# EAGLE design simple_record (EAGLE 6.5.0)
AUTHOR: Joshua Adkins; REV: B; TITLE: SIMPLE_RECORD
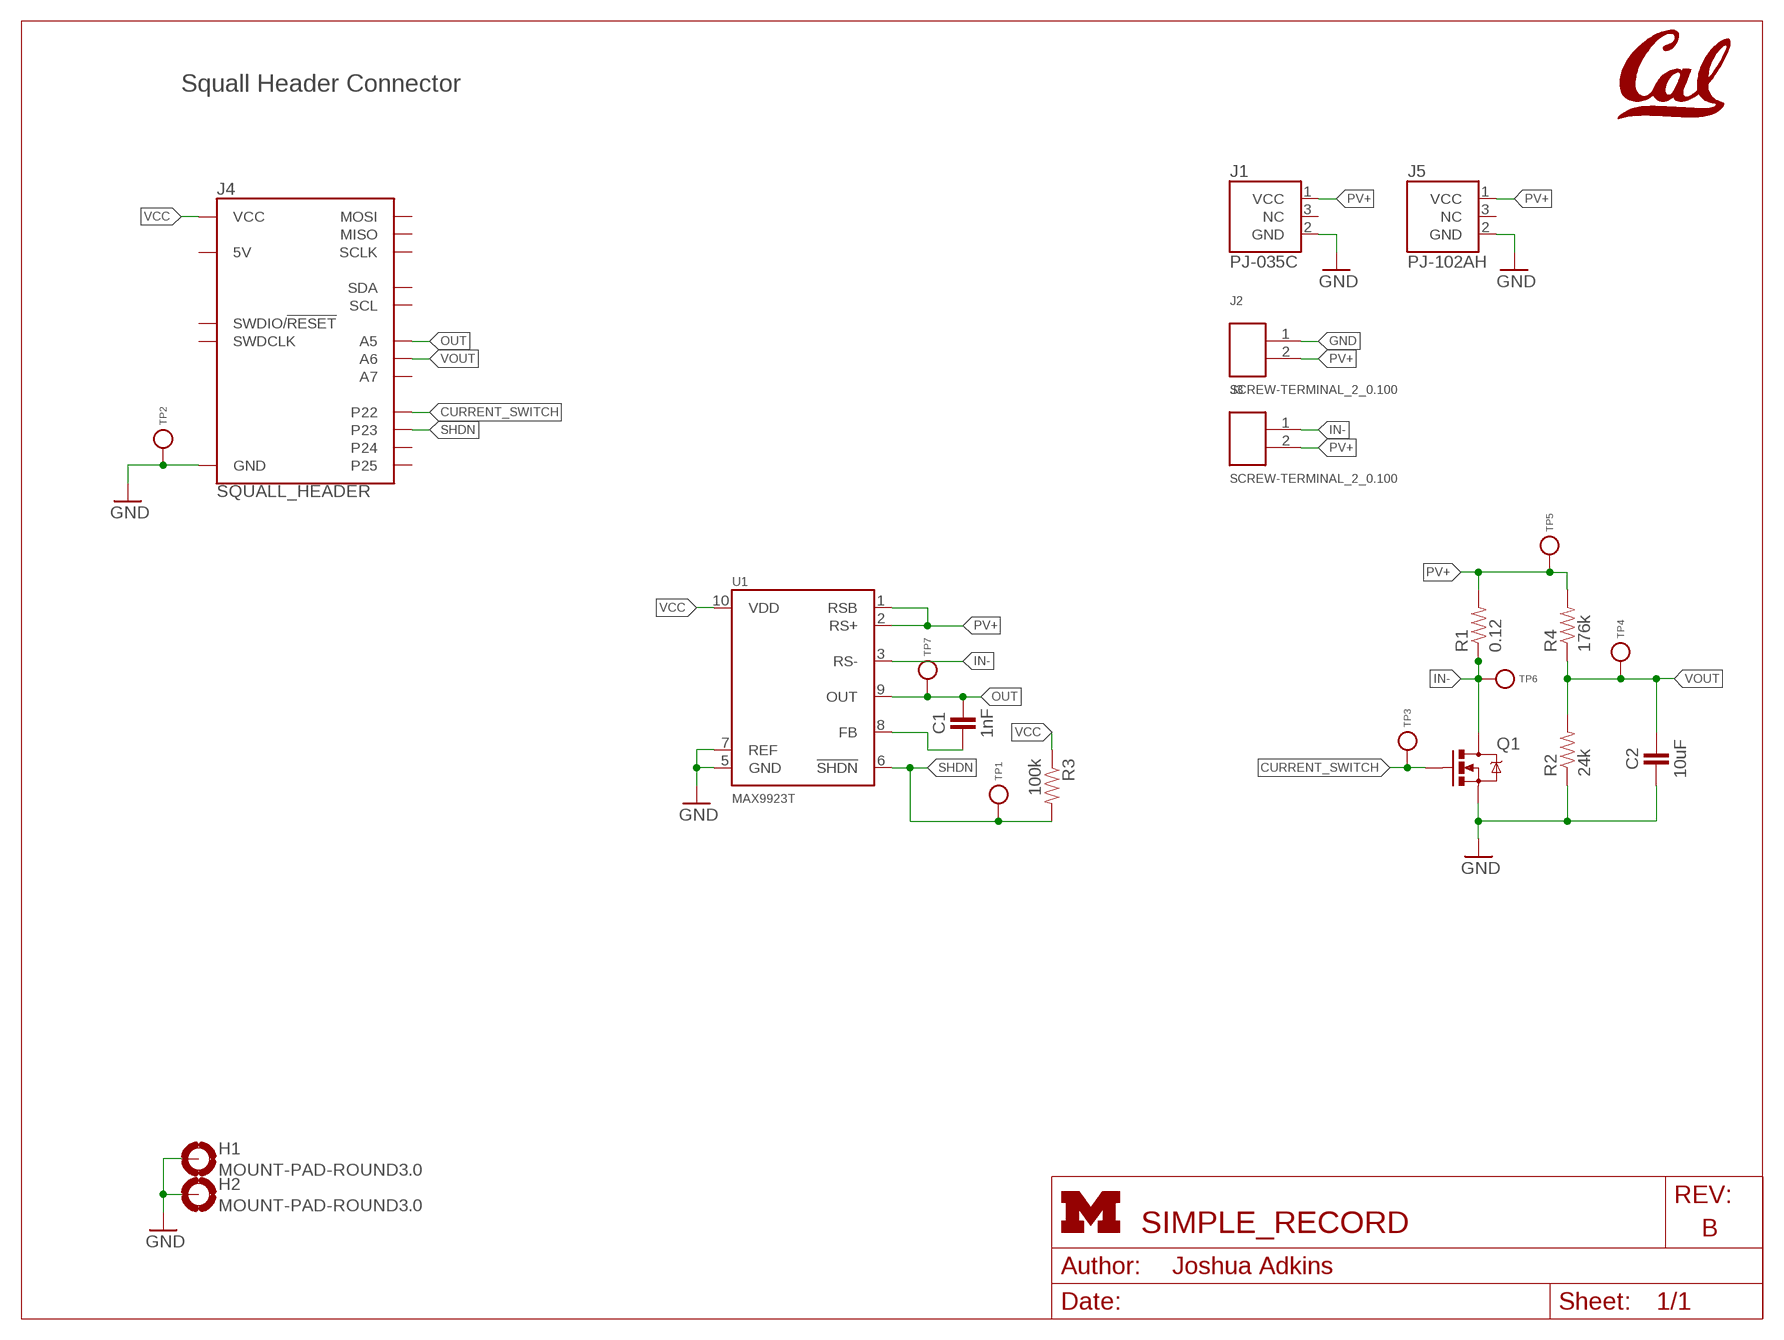
[diagram p0: schematic, sheet 1]
FRAME1 (LETTER_L): HEIGHT: 8.5in; WIDTH: 11in

## Parts
C1  1nF  CAPACITOR  [0402_CAP]
C2  10uF  CAPACITOR0603_CAP  [0603_CAP]
H1  MOUNT-PAD-ROUND3.0  [3,0-PAD]
H2  MOUNT-PAD-ROUND3.0  [3,0-PAD]
J1  PJ-035C  [PJ-035C]
J2  SCREW-TERMINAL_2_0.100  [CONN_BLOCK_2]
J3  SCREW-TERMINAL_2_0.100  [CONN_BLOCK_2]
J4  SQUALL_HEADER  [SQUALL_HEADER]
J5  PJ-102AH  [PJ-102AH]
Q1  MOSFET-NCHANNELSMD  [SOT23-3]
R1  0.12  RESISTOR  [0603-RES]
R2  24k  RESISTOR  [0603-RES]
R3  100k  RESISTOR  [0603-RES]
R4  176k  RESISTOR  [0603-RES]
TP1  TEST_POINT_0.040IN  [TESTPOINT_0.040IN]
TP2  TEST_POINT_0.040IN  [TESTPOINT_0.040IN]
TP3  TEST_POINT_0.040IN  [TESTPOINT_0.040IN]
TP4  TEST_POINT_0.040IN  [TESTPOINT_0.040IN]
TP5  TEST_POINT_0.040IN  [TESTPOINT_0.040IN]
TP6  TEST_POINT_0.040IN  [TESTPOINT_0.040IN]
TP7  TEST_POINT_0.040IN  [TESTPOINT_0.040IN]
U1  MAX9923T  MAX9923H  [UMAX10]
U$1  UCB_CAL75MIL  [UCB_CAL_75MIL]

## Nets
CURRENT_SWITCH: J4.A2(P22) Q1.1(G) TP3.TESTPOINT
GND: C2.2 H1.B3,0(MOUNT) H2.B3,0(MOUNT) J1.2(GND) J2.1 J4.A9(GND) J4.A10(GND) J5.2(GND) Q1.2(S) R2.1 TP2.TESTPOINT U1.5(GND) U1.7(REF)
IN-: J3.1 Q1.3(D) R1.1 TP6.TESTPOINT U1.3(RS-)
N$7: C1.2 U1.8(FB)
OUT: C1.1 J4.B9(A5) TP7.TESTPOINT U1.9(OUT)
PV+: J1.1(VCC) J2.2 J3.2 J5.1(VCC) R1.2 R4.2 TP5.TESTPOINT U1.1(RSB) U1.2(RS+)
SHDN: J4.A4(P23) R3.2 TP1.TESTPOINT U1.6(!SHDN)
VCC: J4.A1(VCC) J4.A3(VCC) R3.1 U1.10(VDD)
VOUT: C2.1 J4.B7(A6) R2.2 R4.1 TP4.TESTPOINT
Unconnected: J1.3(NC) J4.A5(5V) J4.A6(P24) J4.A7(5V) J4.A8(P25) J4.B1(SDA) J4.B2(SWDCLK) J4.B3(SCL) J4.B4(SWDIO/!RESET) J4.B5(A7) J4.B6(MOSI) J4.B8(MISO) J4.B10(SCLK) J5.3(NC)

## Notes on the sheet
- Squall Header Connector

## Library data of the parts
C1 C2 = passives:CAPACITOR: 0402 Capacitor
H1 H2 = holes:MOUNT-PAD-ROUND: MOUNTING PAD, round
J1 = connector:PJ-035C: A 1/3.4mm barrel jack part; DIGIKEY: CP-035C-ND
J2 J3 = headers:SCREW-TERMINAL_2_0.100: 2x 0.100 in screw terminal block; DIGIKEY: 277-1273-ND; MOUSER: 651-1725656; NEWARK: 71C4107
J4 = squall:SQUALL_HEADER: Header for a sensor board on top of the Squall BLE tag board. Requires two DF40C-10DS-0.4V(51).; DIGIKEY: H11617CT-ND
J5 = connector:PJ-102AH: DC Power Jack 2.0mm / 5.5mm; DIGIKEY: CP-102AH-ND
Q1 = fets:MOSFET-NCHANNEL: Generic NMOS footprint; DIGIKEY: DMN3023L-7DICT-ND
R1-R4 = passives:RESISTOR: Resistor Basic schematic elements and footprints for 0603, 1206, and PTH resistors.
TP1-TP7 = headers:TEST_POINT_0.040IN: 0.040in Test Point; DIGIKEY: 5001K-ND
U1 = chips:MAX992: The MAX9922/MAX9923 ultra-precision, high-side current- sense amplifiers feature ultra-low offset voltage (VOS) of 25μV (max) and laser-trimmed gain accuracy better than 0.5%. The combination of low VOS and highgain accuracy allows precise current measurements even at very small sense voltages.; DIGIKEY: MAX9923TEUB+TCT-ND
U$1 = logos:UCB_CAL

## Board
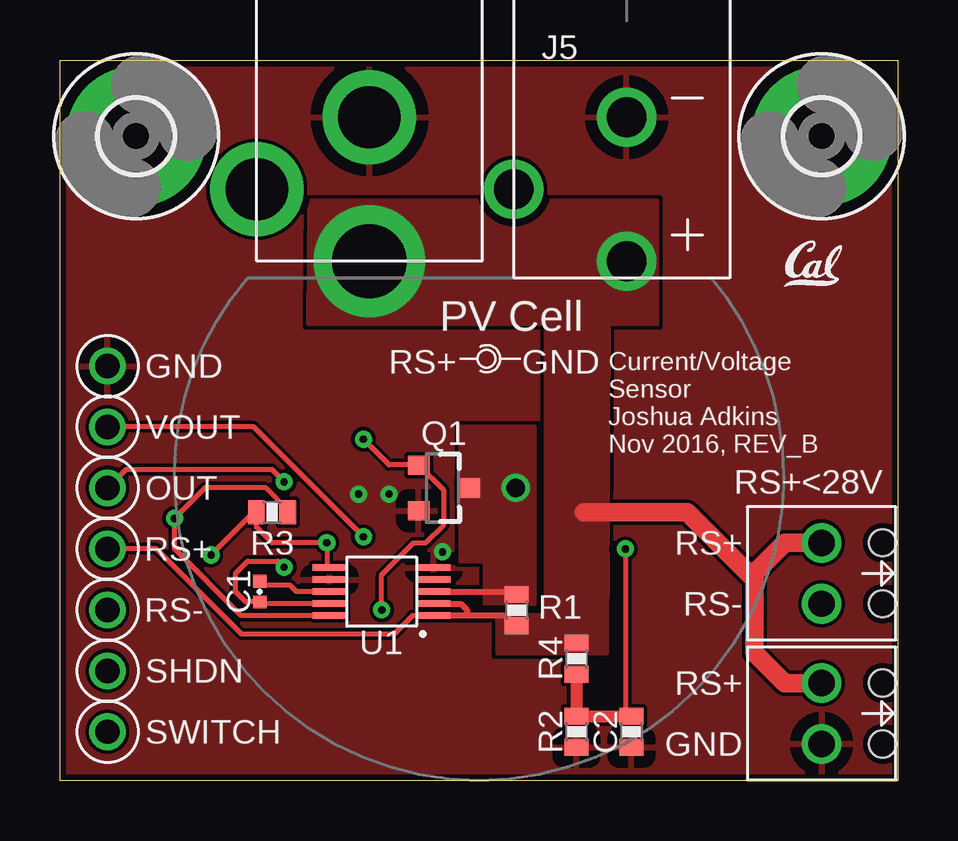
[diagram p1: board, top side]
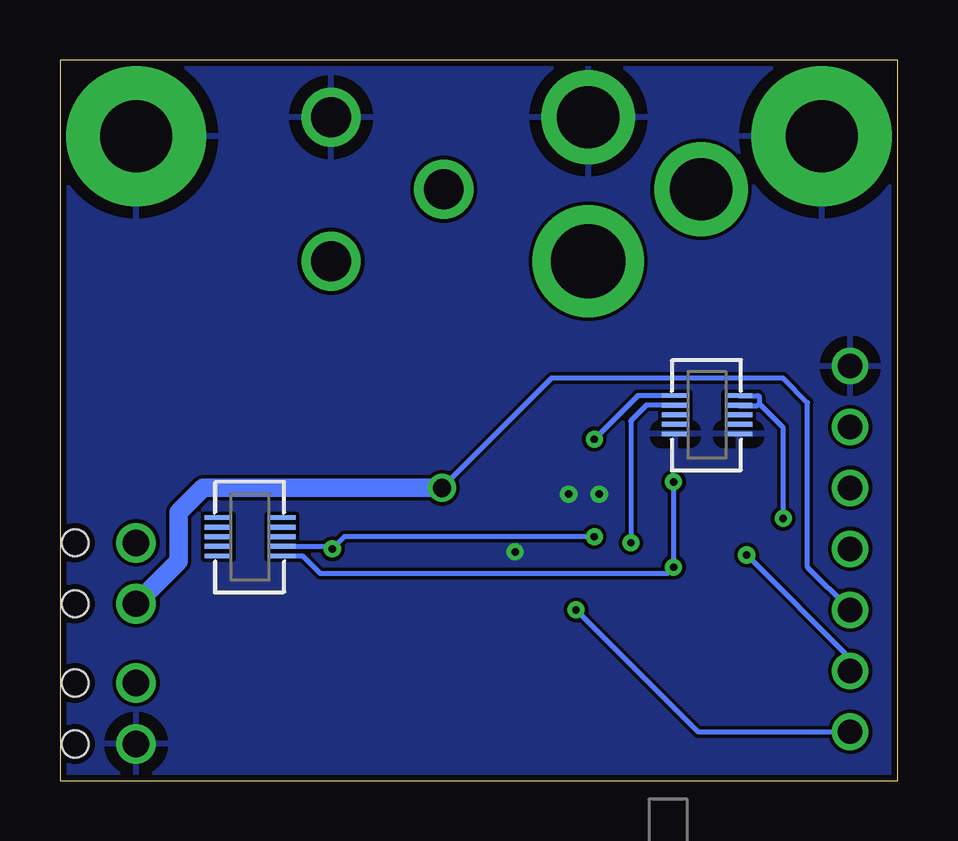
[diagram p2: board, bottom side, seen from below]

Size 34.92 x 30.02 mm. Coordinates in mm from the lower left corner, seen from the top.
Outline: 0,0 0,30.02 34.92,30.02 34.92,0 0,0
Copper layers (1*16): Top 0.0178mm / dielectric 59mil / Bottom 0.0178mm
Design rules "sunstone-2lyr_v1.0.0.3 *": minimum track width 6mil, minimum drill 14mil, track to track 6mil, track to pad 6mil, pad to pad 6mil, via to via 6mil, smd to smd 6mil, copper to edge 10mil, drill to drill 16mil, minimum pad ring 8mil, minimum via ring 8mil, stop-mask expansion 3mil, vias tented up to drill 50mil, thermal gap 20mil

### Footprints (pad centres in the part's own frame; a part is rotated, then mirrored left to right if it is on the bottom)
0402_CAP = smd 0.536 x 0.546: 1 -0.433,0; 2 0.433,0
0603_CAP = smd 0.7 x 1: 1 -0.65,0; 2 0.65,0
3,0-PAD = drill 3 pad 5.842: B3,0 0,0
PJ-035C = drill 3.1 pad 4: 1 0,-3 | drill 2.6 pad 3.5: 2 0,3; 3 -4.7,0
CONN_BLOCK_2 = drill 1.1: 1 -1.27,0; 2 1.27,0 | hole 1.12: -1.27,-2.54; 1.27,-2.54
SQUALL_HEADER = smd 1.14 x 0.2 bottom: A1 -10.845,3.34; A2 -8.205,3.34; A3 -10.845,2.94; A4 -8.205,2.94; A5 -10.845,2.54; A6 -8.205,2.54; A7 -10.845,2.14; A8 -8.205,2.14; A9 -10.845,1.74; A10 -8.205,1.74; B1 8.205,-1.74; B2 10.845,-1.74; B3 8.205,-2.14; B4 10.845,-2.14; B5 8.205,-2.54; B6 10.845,-2.54; B7 8.205,-2.94; B8 10.845,-2.94; B9 8.205,-3.34; B10 10.845,-3.34
PJ-102AH = drill 1.65: 1 0,-3; 2 0,3; 3 -4.7,0
SOT23-3 = smd 0.8 x 0.9: 1 -0.95,-1; 2 0.95,-1; 3 0,1.1
0603-RES = smd 0.7 x 1: 1 -0.65,0; 2 0.65,0
TESTPOINT_0.040IN = drill 1.016: TESTPOINT 0,0
UMAX10 = smd 0.28 x 1.4: 1 -1,-2.17; 2 -0.5,-2.17; 3 0,-2.17; 4 0.5,-2.17; 5 1,-2.17; 6 1,2.17; 7 0.5,2.17; 8 0,2.17; 9 -0.5,2.17; 10 -1,2.17

### Placement (x,y rotation side)
C1  8.33,7.87 90 top
C2  23.83,2.03 270 top
H1  31.75,26.85 0 top
H2  3.17,26.85 0 top
J1  12.9,24.64 0 top
J2  31.75,2.79 90 top
J3  31.75,8.64 90 top
J4  17.48,12.7 0 top
J5  23.62,24.64 0 top
Q1  15.95,12.19 270 top
R1  19.04,7.1 270 top
R2  21.54,2.03 90 top
R3  8.84,11.18 180 top
R4  21.54,5.08 90 top
TP1  1.98,4.57 0 top
TP2  1.98,17.27 0 top
TP3  1.98,2.03 0 top
TP4  1.98,14.73 0 top
TP5  1.98,9.65 0 top
TP6  1.98,7.11 0 top
TP7  1.98,12.19 0 top
U1  13.41,7.87 90 top
U$1  30.18,20.57 0 top

### Tracks (layer width: path | path; a pad name or v marks a point on that pad's centre or on a via)
CURRENT_SWITCH  (via drill 0.3)
  Top 0.203: v13.41,7.11 13.41,8.59 14.73,9.91 15.24,9.91 16,10.67 16,12.09 Q1.1 14.94,13.16 13.71,13.16 v12.65,14.22
  Bottom 0.203: v13.41,7.11 8.33,2.03 TP3.TESTPOINT | J4.A2 10.83,16.04 v12.65,14.22
GND  (via drill 0.3)
  other vias: 13.72,11.94 15.95,9.53 12.45,11.94
  pour Top (rank 2): -0.3,30.48 -0.3,-0.25 35.26,-0.25 35.26,30.48
  pour Bottom (rank 2): -0.3,30.48 -0.3,-0.25 35.26,-0.25 35.26,30.48
IN-  (via drill 0.76)
  Top 0.254: U1.3 18.92,7.87 R1.1 19,7.79
  Bottom 0.203: TP6.TESTPOINT 3.76,8.89 3.76,15.75 4.78,16.76 14.43,16.76 v19,12.19
  Bottom 0.762: J3.1 29.97,9.14 29.97,11.18 28.96,12.19 v19,12.19
  pour Top (isolate 0.305, no thermals): 19.76,7.37 17.73,7.37 17.73,9.14 16.71,9.14 16.71,14.73 19.76,14.73
N$7
  Top 0.203: U1.8 9.86,7.87 9.6,8.13 8.51,8.13 C1.2
OUT  (via drill 0.3)
  Top 0.203: U1.9 10.98,7.37 8.41,7.37 C1.1 7.75,7.44 7.32,7.87 7.32,8.64 7.82,9.14 9.09,9.14 v9.35,8.89 | v9.35,12.45 8.84,12.95 2.74,12.95 TP7.TESTPOINT
  Bottom 0.203: J4.B9 24.8,9.36 24.08,8.64 9.6,8.64 v9.35,8.89 v9.35,12.45
PV+
  Top 0.203: U1.1 14.7,6.87 13.92,6.1 7.57,6.1 4.01,9.65 TP5.TESTPOINT
  Top 0.254: R1.2 18.62,6.87 16.97,6.87 | 16.97,6.87 U1.1 | U1.2 15.34,7.37 16.71,7.37 16.97,7.11 16.97,6.87
  Top 0.762: J3.2 30.23,9.91 28.96,8.64 28.96,8.38 | 28.96,8.38 28.96,5.33 30.23,4.06 J2.2 | 28.96,8.38 26.16,11.18 21.84,11.18
  pour Top (isolate 0.305, no thermals): 24.89,24.13 10.41,24.13 10.36,19.05 20.27,19.05 20.27,6.86 18.24,6.86 18.24,5.33 22.81,5.33 22.86,19.05 24.89,19.05
SHDN  (via drill 0.3)
  Top 0.203: v6.3,9.4 8.08,11.18 R3.2 8.19,10.56 8.84,9.91 v11.12,9.91 11.12,8.99 U1.6
  Bottom 0.203: J4.A4 10.47,15.64 11.12,14.99 v11.12,9.91 | v6.3,9.4 1.98,5.08 TP1.TESTPOINT
VCC  (via drill 0.3)
  Top 0.203: R3.1 9.49,11.29 8.59,12.19 6.04,12.19 v4.78,10.92 4.78,9.65 7.55,6.87 U1.10
  Bottom 0.203: J4.A1 5.82,16.04 5.78,16 5.78,15.7 | 5.78,15.7 5.88,15.6 6.59,15.6 J4.A3 | v4.78,10.92 4.78,14.7 5.78,15.7
VOUT  (via drill 0.3)
  Top 0.203: v23.57,9.65 23.57,2.94 C2.1 | v12.65,10.16 8.08,14.73 TP4.TESTPOINT
  Top 0.508: R4.1 R2.2 C2.1
  Bottom 0.203: J4.B7 23.68,9.76 v23.57,9.65 23.06,10.16 v12.65,10.16

### Text on the board
tNames: PV Cell | GND | GND | RS+ | VOUT | Current/Voltage / Sensor / Joshua Adkins / Nov 2016, REV_B | OUT | RS+<28V | RS+ | RS+ | RS- | RS- | SHDN | RS+ | SWITCH | GND